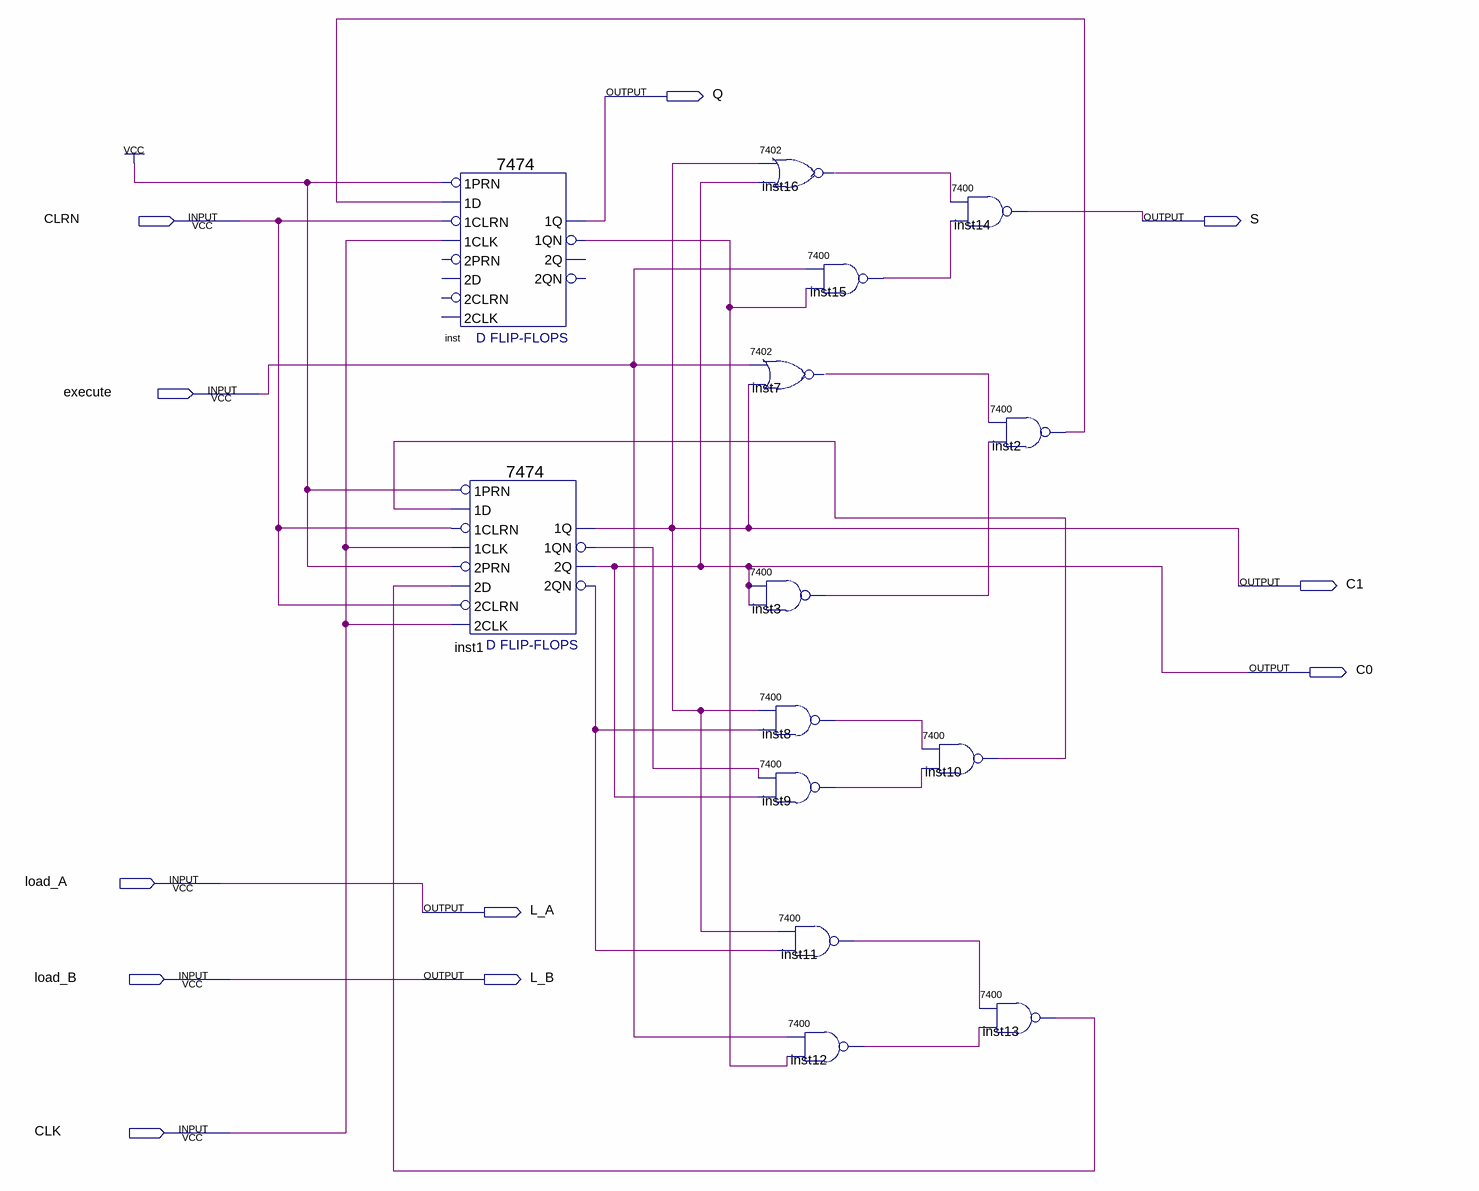
[diagram p0: schematic sheet]
// Quartus schematic lab3.bdf as structural Verilog: 14 symbols, 11 pins
module lab3 (
  input  CLRN,
  input  execute,
  input  load_A,
  input  load_B,
  input  CLK,
  output Q,
  output S,
  output C1,
  output C0,
  output L_A,
  output L_B
);

  wire inst1_1qn, inst1_2qn, inst2_1, inst3_1, inst7_1, inst8_1, inst9_1, inst10_1, inst11_1, inst12_1,
       inst13_1, inst15_1, inst16_1, inst_1qn;

  \7474  inst (
    .\1CLK (CLK), .\1D (inst2_1), .\1PRN (1'b1), .\1CLRN (CLRN), .\1QN (inst_1qn), .\1Q (Q));  // open: 2D, 2PRN, 2CLK, 2CLRN, 2Q, 2QN
  \7474  inst1 (
    .\2D (inst13_1), .\2PRN (1'b1), .\1CLK (CLK), .\1D (inst10_1), .\1PRN (1'b1), .\2CLK (CLK),
    .\2CLRN (CLRN), .\1CLRN (CLRN), .\1QN (inst1_1qn), .\2Q (C0), .\2QN (inst1_2qn), .\1Q (C1));
  \7402  inst7 (.\2 (execute), .\3 (C1), .\1 (inst7_1));
  \7400  inst3 (.\3 (C0), .\2 (C0), .\1 (inst3_1));
  \7402  inst16 (.\2 (C1), .\3 (C0), .\1 (inst16_1));
  \7400  inst15 (.\3 (inst_1qn), .\2 (execute), .\1 (inst15_1));
  \7400  inst8 (.\3 (inst1_2qn), .\2 (C1), .\1 (inst8_1));
  \7400  inst9 (.\3 (C0), .\2 (inst1_1qn), .\1 (inst9_1));
  \7400  inst11 (.\3 (inst1_2qn), .\2 (C1), .\1 (inst11_1));
  \7400  inst12 (.\3 (inst_1qn), .\2 (execute), .\1 (inst12_1));
  \7400  inst14 (.\3 (inst15_1), .\2 (inst16_1), .\1 (S));
  \7400  inst10 (.\3 (inst9_1), .\2 (inst8_1), .\1 (inst10_1));
  \7400  inst13 (.\3 (inst12_1), .\2 (inst11_1), .\1 (inst13_1));
  \7400  inst2 (.\3 (inst3_1), .\2 (inst7_1), .\1 (inst2_1));

  assign L_A = load_A;
  assign L_B = load_B;
endmodule
